# EAGLE design low_side_mcu (EAGLE 9.6.2)
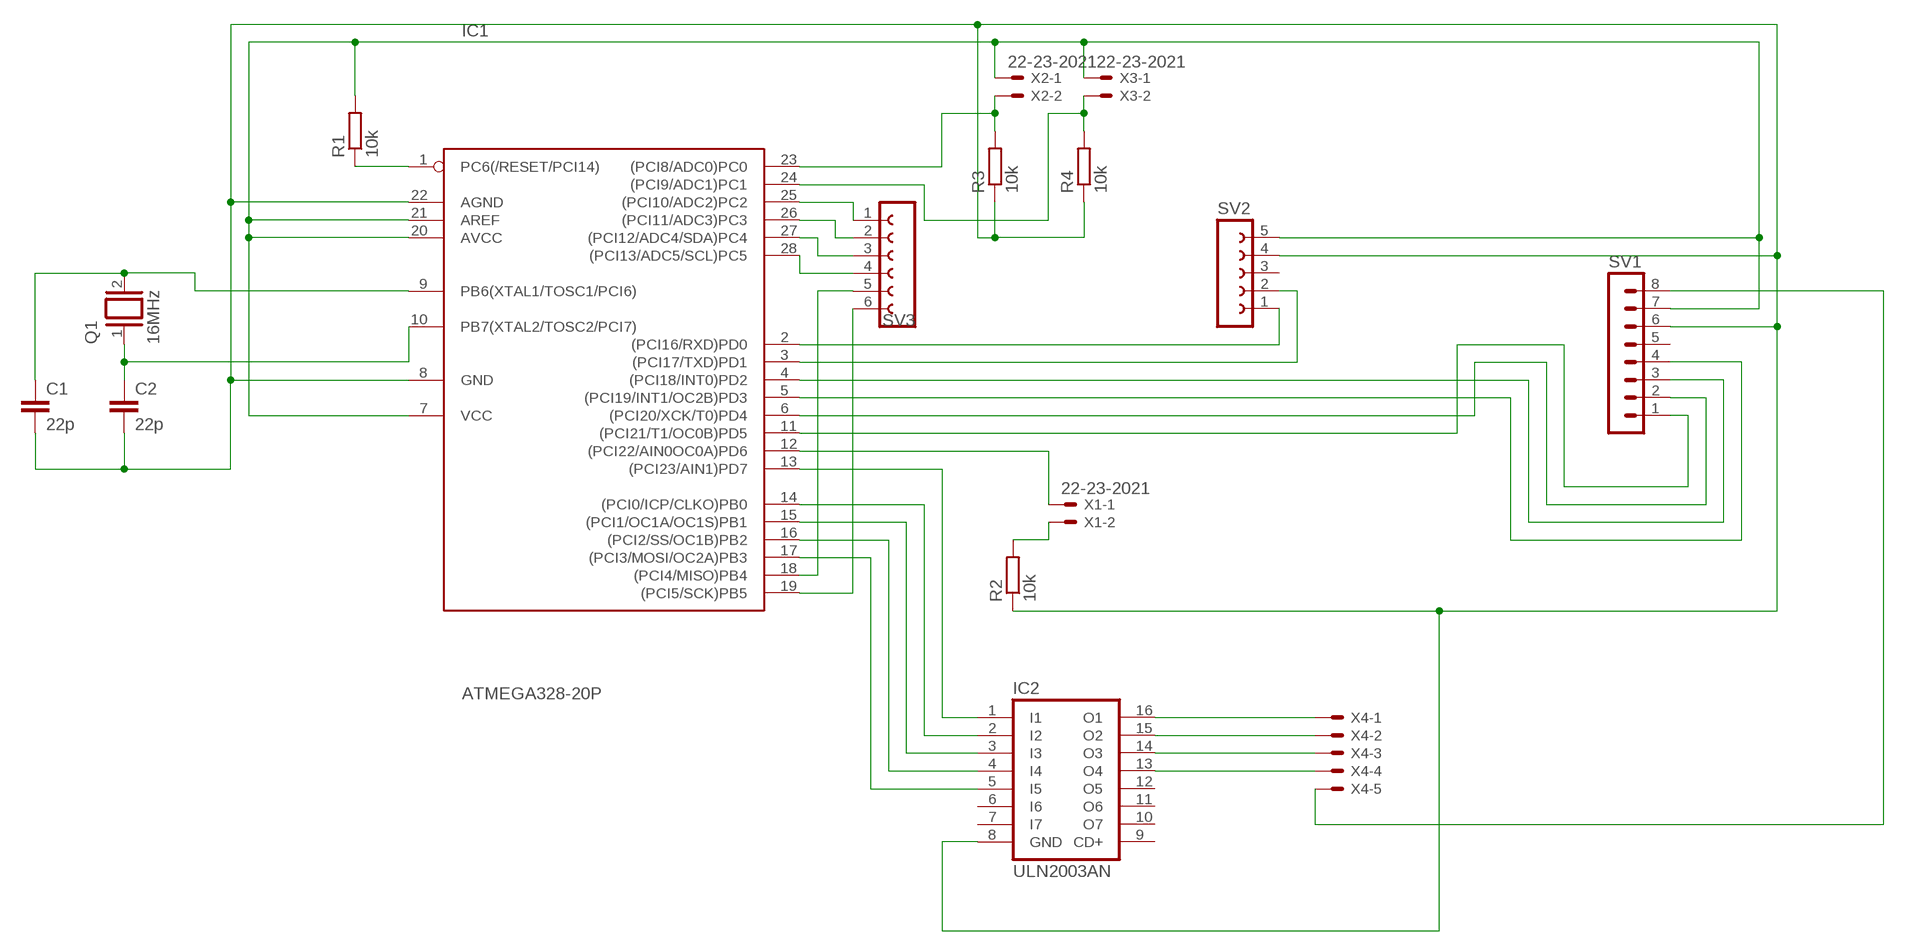
[diagram p0: schematic, sheet 1]

## Parts
C1  22p  C-EU025-024X044  [C025-024X044]
C2  22p  C-EU025-024X044  [C025-024X044]
IC1  ATMEGA328-20P  [DIL28-3]
IC2  ULN2003AN  [DIL16]
Q1  16MHz  XTAL  [Q]
R1  10k  R-EU_0204/5  [0204/5]
R2  10k  R-EU_0204/5  [0204/5]
R3  10k  R-EU_0204/5  [0204/5]
R4  10k  R-EU_0204/5  [0204/5]
SV1  MA08-1  [MA08-1]
SV2  FE05-1  [FE05-1]
SV3  FE06-1  [FE06]
X1  22-23-2021  [22-23-2021]
X2  22-23-2021  [22-23-2021]
X3  22-23-2021  [22-23-2021]
X4  KK-156-5  [KK-156-5]

## Nets
N$1 [v_dc]: IC1.7(VCC) IC1.20(AVCC) IC1.21(AREF) R1.2 SV1.7 SV2.5 X2.1 X3.1
N$3 [v_dc]: IC1.1(PC6(/RESET/PCI14)) R1.1
N$4 [v_dc]: C1.1 IC1.9(PB6(XTAL1/TOSC1/PCI6)) Q1.2
N$5 [v_dc]: C2.1 IC1.10(PB7(XTAL2/TOSC2/PCI7)) Q1.1
N$6 [v_dc]: IC1.11((PCI21/T1/OC0B)PD5) SV1.1
N$7 [v_dc]: IC1.12((PCI22/AIN0OC0A)PD6) X1.1
N$8 [v_dc]: IC1.4((PCI18/INT0)PD2) SV1.3
N$9 [v_dc]: IC1.5((PCI19/INT1/OC2B)PD3) SV1.4
N$10 [v_dc]: IC1.6((PCI20/XCK/T0)PD4) SV1.2
N$11 [v_dc]: IC1.2((PCI16/RXD)PD0) SV2.1
N$12 [v_dc]: IC1.3((PCI17/TXD)PD1) SV2.2
N$13 [v_dc]: R2.2 X1.2
N$14 [v_dc]: IC1.23((PCI8/ADC0)PC0) R3.2 X2.2
N$15 [v_dc]: IC2.16(O1) X4.1
N$16 [v_dc]: IC1.13((PCI23/AIN1)PD7) IC2.1(I1)
N$17 [v_dc]: IC1.14((PCI0/ICP/CLKO)PB0) IC2.2(I2)
N$18 [v_dc]: IC1.24((PCI9/ADC1)PC1) R4.2 X3.2
N$19 [v_dc]: IC1.15((PCI1/OC1A/OC1S)PB1) IC2.3(I3)
N$20 [v_dc]: IC1.16((PCI2/SS/OC1B)PB2) IC2.4(I4)
N$21 [v_dc]: IC1.17((PCI3/MOSI/OC2A)PB3) IC2.5(I5)
N$22 [v_dc]: IC2.15(O2) X4.2
N$23 [v_dc]: IC2.14(O3) X4.3
N$24 [v_dc]: IC2.13(O4) X4.4
N$25 [v_dc]: SV1.8 X4.5
N$26 [v_dc]: IC1.25((PCI10/ADC2)PC2) SV3.1
N$27 [v_dc]: IC1.26((PCI11/ADC3)PC3) SV3.2
N$28 [v_dc]: IC1.27((PCI12/ADC4/SDA)PC4) SV3.3
N$29 [v_dc]: IC1.28((PCI13/ADC5/SCL)PC5) SV3.4
N$30 [v_dc]: IC1.18((PCI4/MISO)PB4) SV3.5
N$31 [v_dc]: IC1.19((PCI5/SCK)PB5) SV3.6
N$32 [gnd]: C1.2 C2.2 IC1.8(GND) IC1.22(AGND) IC2.8(GND) R2.1 R3.1 R4.1 SV1.6 SV2.4
Unconnected: IC2.6(I6) IC2.7(I7) IC2.9(CD+) IC2.10(O7) IC2.11(O6) IC2.12(O5) SV1.5 SV2.3

## Library data of the parts
C1 C2 = rcl:C-EU: CAPACITOR, European symbol; SPICEPREFIX: C
IC1 = atmega328:ATMEGA328*P: MICROCONTROLLER 32 kBytes FLASH 2 kBytes SRAM 1 kBytes EEPROM USART 8-channel 10 bit ADC
IC2 = uln-udn:ULN2003A: DRIVER ARRAY
Q1 = special:XTAL: CRYSTAL
R1-R4 = rcl:R-EU_: RESISTOR, European symbol; SPICEPREFIX: R
SV1 = con-lstb:MA08-1: PIN HEADER; OC_FARNELL: unknown; OC_NEWARK: unknown
SV2 = con-lsta:FE05-1: FEMALE HEADER; OC_FARNELL: unknown; OC_NEWARK: unknown
SV3 = con-lsta:FE06-1: FEMALE HEADER; OC_FARNELL: unknown; OC_NEWARK: unknown
X1-X3 = con-molex:22-23-2021: .100" (2.54mm) Center Header - 2 Pin; MF: MOLEX; MPN: 22-23-2021; OC_FARNELL: 1462926; OC_NEWARK: 25C3832
X4 = con-molex:KK-156-5: KK 156 HEADER Source: http://www.molex.com/pdm_docs/sd/026604100_sd.pdf; MF: MOLEX; OC_FARNELL: unknown; OC_NEWARK: unknown

## Net classes
1 v_dc: width 0.406 mm, clearance 0.127 mm
2 gnd: width 0.406 mm, clearance 0.127 mm

## Board
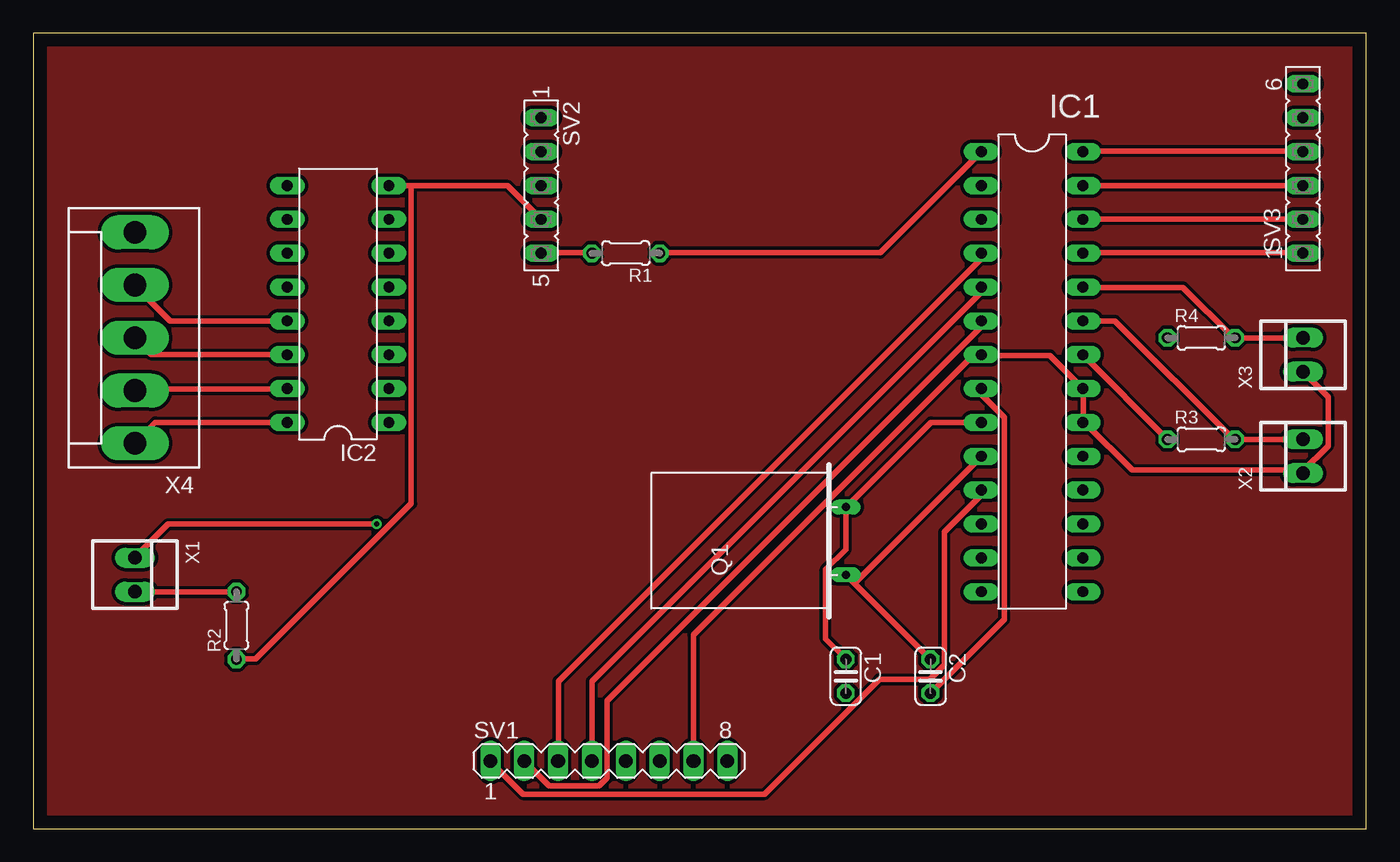
[diagram p1: board, top side]
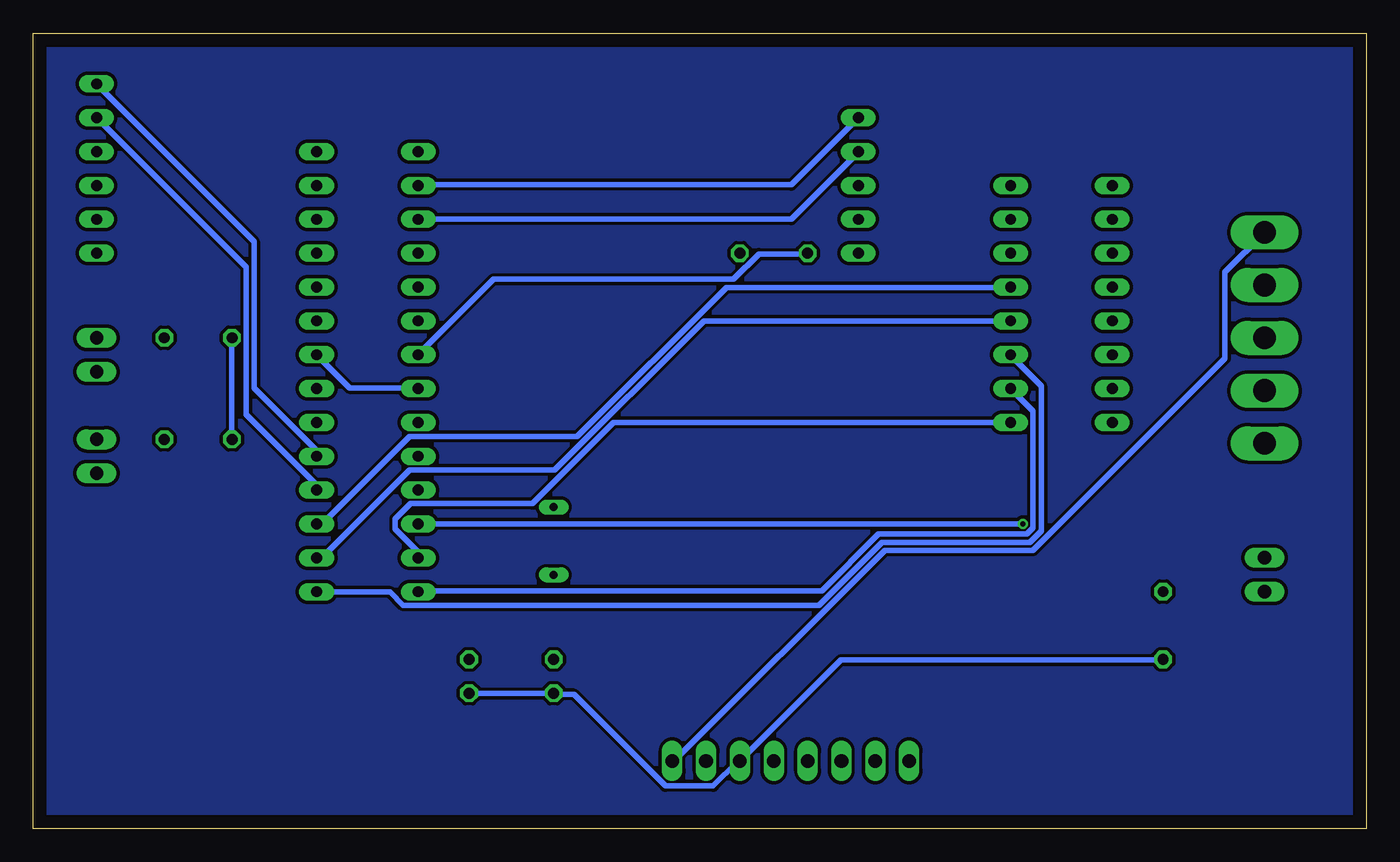
[diagram p2: board, bottom side, seen from below]

Size 100 x 59.68 mm. Coordinates in mm from the lower left corner, seen from the top.
Outline: 0,0 100,0 100,59.68 0,59.68 0,0
Copper layers (1*16): Top 0.035mm / dielectric 1.5mm / Bottom 0.035mm
Design rules "default": minimum track width 6mil, minimum drill 0.35mm, track to track 6mil, track to pad 6mil, pad to pad 6mil, via to via 6mil, smd to smd 6mil, copper to edge 40mil, drill to drill 6mil, minimum pad ring 10mil, minimum via ring 8mil, stop-mask expansion 4mil, vias tented up to drill 0mil, thermal gap 10mil

### Footprints (pad centres in the part's own frame; a part is rotated, then mirrored left to right if it is on the bottom)
C025-024X044 = drill 0.813 octagon: 1 -1.27,0; 2 1.27,0
DIL28-3 = drill 0.813 long: 1 -16.51,-3.81; 2 -13.97,-3.81; 3 -11.43,-3.81; 4 -8.89,-3.81; 5 -6.35,-3.81; 6 -3.81,-3.81; 7 -1.27,-3.81; 8 1.27,-3.81; 9 3.81,-3.81; 10 6.35,-3.81; 11 8.89,-3.81; 12 11.43,-3.81; 13 13.97,-3.81; 14 16.51,-3.81; 15 16.51,3.81; 16 13.97,3.81; 17 11.43,3.81; 18 8.89,3.81; 19 6.35,3.81; 20 3.81,3.81; 21 1.27,3.81; 22 -1.27,3.81; 23 -3.81,3.81; 24 -6.35,3.81; 25 -8.89,3.81; 26 -11.43,3.81; 27 -13.97,3.81; 28 -16.51,3.81
DIL16 = drill 0.813 long: 1 -8.89,-3.81; 2 -6.35,-3.81; 3 -3.81,-3.81; 4 -1.27,-3.81; 5 1.27,-3.81; 6 3.81,-3.81; 7 6.35,-3.81; 8 8.89,-3.81; 9 8.89,3.81; 10 6.35,3.81; 11 3.81,3.81; 12 1.27,3.81; 13 -1.27,3.81; 14 -3.81,3.81; 15 -6.35,3.81; 16 -8.89,3.81
Q = drill 0.61 long: 1 -2.54,-7.62; 2 2.54,-7.62
0204/5 = drill 0.813 octagon: 1 -2.54,0; 2 2.54,0
MA08-1 = drill 1.016 long: 1 -8.89,0; 2 -6.35,0; 3 -3.81,0; 4 -1.27,0; 5 1.27,0; 6 3.81,0; 7 6.35,0; 8 8.89,0
FE05-1 = drill 0.813 long: 1 -5.08,0; 2 -2.54,0; 3 0,0; 4 2.54,0; 5 5.08,0
FE06 = drill 0.813 long: 1 -6.35,0; 2 -3.81,0; 3 -1.27,0; 4 1.27,0; 5 3.81,0; 6 6.35,0
22-23-2021 = drill 1 long: 1 -1.27,0; 2 1.27,0
KK-156-5 = drill 1.7 pad 2.184 long: 1 -7.92,0; 2 -3.96,0; 3 0,0; 4 3.96,0; 5 7.92,0

### Placement (x,y rotation side)
C1  60.96,11.43 270 top
C2  67.31,11.43 270 top
IC1  74.93,34.29 270 top
IC2  22.86,39.37 90 top
Q1  53.34,21.59 90 top
R1  44.45,43.18 180 top
R2  15.24,15.24 90 top
R3  87.63,29.21 0 top
R4  87.63,36.83 0 top
SV1  43.18,5.08 0 top
SV2  38.1,48.26 270 top
SV3  95.25,49.53 90 top
X1  7.62,19.05 270 top
X2  95.25,27.94 90 top
X3  95.25,35.56 90 top
X4  7.62,36.83 90 top

### Tracks (layer width: path | path; a pad name or v marks a point on that pad's centre or on a via)
GND
  pour Top (isolate 0.254): 0,59.69 0,0 100.33,0 100.33,59.69
  pour Bottom (isolate 0.254): 0,59.69 0,0 100.33,0 100.33,59.69
N$1
  Top 0.406: X3.1 97.16,32.38 97.16,28.73 95.25,26.82 X2.1 95.1,26.9 82.45,26.9 78.94,30.4 IC1.20 78.79,30.48 78.79,32.84 IC1.21 78.72,33.07 76.28,35.51 71.17,35.51 IC1.7 70.94,35.51 70.48,35.51 49.53,14.55 SV1.7 | SV2.5 38.1,43.2 41.91,43.2 R1.2
  Bottom 0.406: IC1.7 65.46,41.22 47.47,41.22 45.57,43.13 41.91,43.13 R1.2
N$3
  Top 0.406: R1.1 47.02,43.2 63.55,43.2 71.09,50.75 IC1.1
N$4
  Top 0.406: C1.1 60.96,12.72 59.44,14.25 59.44,19.43 60.96,20.95 Q1.2 61.11,24.23 67.36,30.48 IC1.9
N$5
  Top 0.406: C2.1 Q1.1 61.72,18.52 71.09,27.89 IC1.10
N$6
  Top 0.406: IC1.11 71.09,25.38 71.09,24.99 68.35,22.25 68.35,12.27 67.28,11.2 63.48,11.2 54.86,2.59 36.73,2.59 34.29,5.03 SV1.1
N$7  (via drill 0.35)
  Top 0.406: v25.76,22.86 10.13,22.86 7.62,20.34 X1.1
  Bottom 0.406: v25.76,22.86 IC1.12
N$8
  Top 0.406: IC1.4 71.09,43.13 71.09,42.75 39.4,11.05 39.4,5.11 SV1.3
N$9
  Top 0.406: SV1.4 41.91,11.05 71.09,40.23 71.09,40.62 IC1.5
N$10
  Top 0.406: SV1.2 38.71,3.2 42.44,3.2 43.05,3.81 43.05,9.6 71.09,37.64 71.09,38.1 IC1.6
N$11
  Bottom 0.406: SV2.1 43.13,48.31 71.09,48.31 IC1.2
N$12
  Bottom 0.406: IC1.3 43.13,45.72 38.1,50.75 SV2.2
N$13
  Top 0.406: R2.2 15.24,17.75 7.62,17.75 X1.2
N$14
  Top 0.406: X2.2 95.25,29.18 90.22,29.18 R3.2 89.99,29.26 81.15,38.1 IC1.23
N$15
  Top 0.406: IC2.16 9.14,30.48 7.62,28.96 X4.1
N$16
  Bottom 0.406: IC2.1 56.46,30.48 62.56,24.38 71.7,24.38 72.85,23.24 72.85,22.48 71.17,20.8 71.17,20.34 IC1.13
N$17
  Bottom 0.406: IC1.14 71.09,17.83 40.84,17.83 36.58,22.1 25.45,22.1 24.99,22.55 24.99,31.32 26.67,32.99 IC2.2
N$18
  Top 0.406: X3.2 95.25,36.8 90.22,36.8 R4.2 89.99,36.88 86.26,40.62 78.79,40.62 IC1.24
N$19
  Bottom 0.406: IC1.15 78.72,17.75 73.23,17.75 72.24,16.76 41.07,16.76 36.35,21.49 25.22,21.49 24.38,22.33 24.38,33.22 26.67,35.51 IC2.3
N$20
  Bottom 0.406: IC2.4 49.68,38.1 60.88,26.9 71.78,26.9 78.33,20.34 78.72,20.34 IC1.16
N$21
  Bottom 0.406: IC1.17 78.33,22.86 71.78,29.41 59.21,29.41 48.01,40.62 26.67,40.62 IC2.5
N$22
  Top 0.406: IC2.15 19.05,32.99 7.7,32.99 7.62,32.92 X4.2
N$23
  Top 0.406: IC2.14 19.05,35.59 8.84,35.59 7.62,36.8 X4.3
N$24
  Top 0.406: IC2.13 10.29,38.1 7.62,40.77 X4.4
N$25
  Bottom 0.406: SV1.8 52.05,5.11 51.89,5.11 36.12,20.88 24.99,20.88 10.59,35.28 10.59,41.76 7.62,44.73 X4.5
N$26
  Top 0.406: IC1.25 78.79,43.2 95.25,43.2 SV3.1
N$27
  Top 0.406: SV3.2 IC1.26
N$28
  Top 0.406: IC1.27 78.79,48.23 95.25,48.23 SV3.3
N$29
  Top 0.406: IC1.28 78.79,50.83 95.25,50.83 SV3.4
N$30
  Bottom 0.406: SV3.5 84.05,42.14 84.05,31.09 78.79,25.83 78.79,25.45 IC1.18
N$31
  Bottom 0.406: IC1.19 78.79,27.96 78.79,28.42 83.44,33.07 83.44,44.04 95.25,55.85 SV3.6
N$32
  Top 0.406: IC1.22 R3.1 | 28.35,48.23 35.59,48.23 SV2.4 | 28.35,48.23 26.67,48.23 IC2.8 | 28.35,48.23 28.35,24.38 16.69,12.72 15.24,12.72 R2.1 | C2.2 72.85,15.7 72.85,30.86 71.17,32.54 71.17,32.99 IC1.8
  Bottom 0.406: R3.1 85.11,29.26 85.11,36.8 R4.1 | IC1.8 71.17,33.07 76.28,33.07 78.72,35.51 IC1.22 | C2.2 67.28,10.13 60.96,10.13 C1.2 60.81,10.06 59.44,10.06 52.58,3.2 49,3.2 47.17,5.03 SV1.6 46.94,5.11 39.4,12.65 15.24,12.65 R2.1